# Altium schematic sheet SCH_Altium_OpenComs_APSM1_2023-05-12.schdoc
size 170 x 109 mm
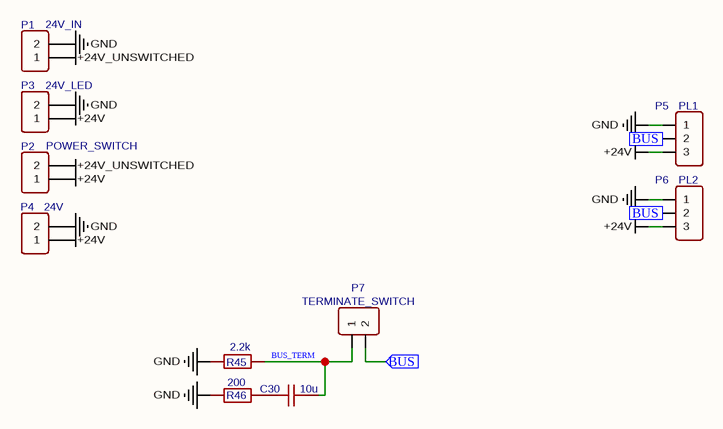
[diagram p0: SCH_Altium_OpenComs_APSM1_2023-05-12.schdoc]

## Parts
C30  10u  [C1206]
P1  24V_IN  [CONN-TH_2P-P5.00]
P2  POWER_SWITCH  [CONN-TH_2P-P5.00]
P3  24V_LED  [CONN-TH_2P-P5.00]
P4  24V  [CONN-TH_2P-P5.00]
P5  PL1  [CONN-TH_3P-P5.00]
P6  PL2  [CONN-TH_3P-P5.00]
P7  TERMINATE_SWITCH  [CONN-TH_2P-P5.00]
R45  2.2k  [R0805]
R46  200  [R0805]

## Ports
BUS (in)

## Nets
+24V: P2.1 P3.1 P4.1 P5.3 P6.3
+24V_UNSWITCHED: P1.1 P2.2
GND: P1.2 P3.2 P4.2 P5.1 P6.1 R45.1 R46.2
BUS: P5.2 P6.2 P7.2 ; port BUS
BUS_TERM: C30.2 P7.1 R45.2
NetC30_1: C30.1 R46.1

## Library data of the parts
C30 = 10u: BOM_Manufacturer Part: CL31A106KBHNNNE; BOM_Manufacturer: SAMSUNG(三星); nameAlias: Value(F); Contributor: LCEDA_Lib; BOM_Supplier Part: C13585; BOM_Supplier: LCSC; spicePre: C; spiceSymbolName: C_1206_US
P1 = 24V_IN: Contributor: LCEDA_Lib; BOM_Supplier: LCSC; spicePre: P; spiceSymbolName: CONN-TH_2P-P5.00
P2 = POWER_SWITCH: Contributor: LCEDA_Lib; BOM_Supplier: LCSC; spicePre: P; spiceSymbolName: CONN-TH_2P-P5.00
P3 = 24V_LED: Contributor: LCEDA_Lib; BOM_Supplier: LCSC; spicePre: P; spiceSymbolName: CONN-TH_2P-P5.00
P4 = 24V: Contributor: LCEDA_Lib; BOM_Supplier: LCSC; spicePre: P; spiceSymbolName: CONN-TH_2P-P5.00
P5 = PL1: Contributor: LCEDA_Lib; BOM_Supplier: LCSC; spicePre: P; spiceSymbolName: CONN-TH_3P-P5.00
P6 = PL2: Contributor: LCEDA_Lib; BOM_Supplier: LCSC; spicePre: P; spiceSymbolName: CONN-TH_3P-P5.00
P7 = TERMINATE_SWITCH: Contributor: LCEDA_Lib; BOM_Supplier: LCSC; spicePre: P; spiceSymbolName: CONN-TH_2P-P5.00
R45 = 2.2k: BOM_Manufacturer Part: 0805W8F2201T5E; BOM_Manufacturer: UNI-ROYAL(厚声); nameAlias: Value(Ω); Contributor: LCEDA_Lib; BOM_Supplier Part: C17520; BOM_Supplier: LCSC; spicePre: R; spiceSymbolName: R_1206_EU
R46 = 200: BOM_Manufacturer Part: 0805W8F2000T5E; BOM_Manufacturer: UNI-ROYAL(厚声); nameAlias: Value(Ω); Contributor: LCEDA_Lib; BOM_Supplier Part: C17540; BOM_Supplier: LCSC; spicePre: R; spiceSymbolName: R_1206_EU